# EAGLE design SMD_DC_DC_Converter_Test_LXDC2HL33A_055 (EAGLE 7.2.0)
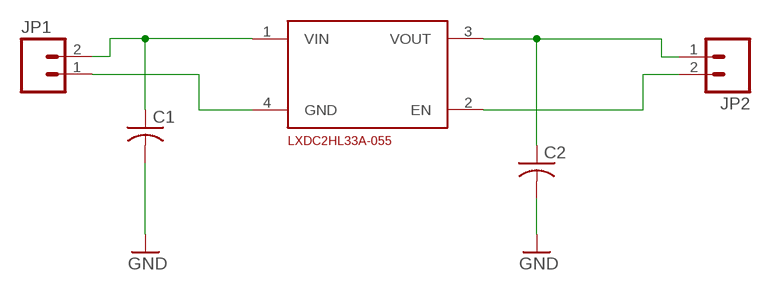
[diagram p0: schematic, sheet 1]

## Parts
C1  C-USC0805K  [C0805K]
C2  C-USC0805K  [C0805K]
JP1  M02LOCK  [1X02_LOCK]
JP2  M02LOCK  [1X02_LOCK]
U$1  LXDC2HL33A-055  [LXDC2HL33A-055]

## Nets
EN: JP2.2 U$1.2(EN)
GND: C1.2 C2.2 JP1.1 U$1.4(GND)
VIN: C1.1 JP1.2 U$1.1(VIN)
VOUT: C2.1 JP2.1 U$1.3(VOUT)

## Library data of the parts
C1 C2 = resistor:C-US: CAPACITOR, American symbol
JP1 JP2 = SparkFun-Connectors:M02: Standard 2-pin 0.1" header. Use with - straight break away headers ( PRT-00116) - right angle break away headers (PRT-00553) - swiss pins (PRT-00743) - machine pins (PRT-00117) - female headers (PRT-00115) Molex polarized connector foot print use with: PRT-08233 with associated crimp pins and housings. 2.54_SCREWTERM for use with PRT-10571. 3.5mm Screw Terminal footprints for PRT-08084 5mm Screw Terminal footprints for use with PRT-08432
U$1 = My Library 15:LXDC2HL33A-055

## Board
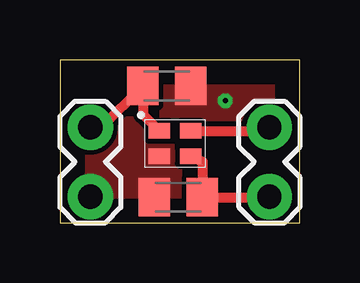
[diagram p1: board, top side]
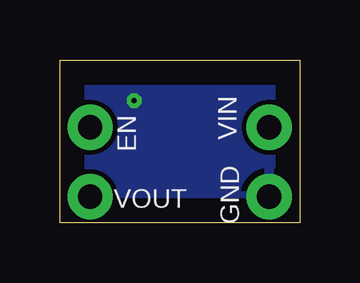
[diagram p2: board, bottom side, seen from below]

Size 10 x 6.8 mm. Coordinates in mm from the lower left corner, seen from the top.
Outline: 0,0 10,0 10,6.8 0,6.8 0,0
Copper layers (1*16): Top 0.035mm / dielectric 1.5mm / Bottom 0.035mm
Design rules "default": minimum track width 10mil, minimum drill 24mil, track to track 8mil, track to pad 8mil, pad to pad 8mil, via to via 8mil, smd to smd 8mil, copper to edge 40mil, drill to drill 8mil, minimum pad ring 10mil, minimum via ring 8mil, stop-mask expansion 4mil, vias tented up to drill 0mil, thermal gap 10mil

### Footprints (pad centres in the part's own frame; a part is rotated, then mirrored left to right if it is on the bottom)
C0805K = smd 1.3 x 1.6: 1 -1,0; 2 1,0
1X02_LOCK = drill 1.016 pad 1.88: 1 -0.178,0; 2 2.718,0
LXDC2HL33A-055 = smd 0.9 x 0.65: 1 0.6,-0.472; 2 1.9,-0.472; 3 1.9,-1.525; 4 0.6,-1.525

### Placement (x,y rotation side)
C1  4.46,5.71 0 top
C2  4.94,1.07 180 top
JP1  1.27,1.27 90 top
JP2  8.74,1.27 90 top
U$1  3.55,4.31 0 top

### Tracks (layer width: path | path; a pad name or v marks a point on that pad's centre or on a via)
EN
  Top 0.406: U$1.2 8.39,3.84 JP2.2
GND  (via drill 0.2)
  other vias: 6.9,5.1
  pour Bottom: 0.1,0 0.1,6.7 9.9,6.7 9.9,0
  pour Top (no thermals): 0.1,0 0.1,6.7 9.9,6.7 9.9,0
VIN
  Top 0.406: JP1.2 1.74,3.99 C1.1 3.46,4.53 U$1.1
VOUT
  Top 0.406: U$1.3 5.95,2.56 C2.1 8.72,1.07 JP2.1

### Text on the board
bNames: VIN | EN | GND | VOUT